# EasyEDA Pro project programming_jig.eprj

# Schematic Schematic1
Board Name: Board1; Create Date: 2026-01-15; Page Name: P1; Project Name: programming_jig; Schematic Name: Schematic1; Update Date: 2026-01-15; Company: EasyEDA.com; Page Size: A4; Version: V1.0
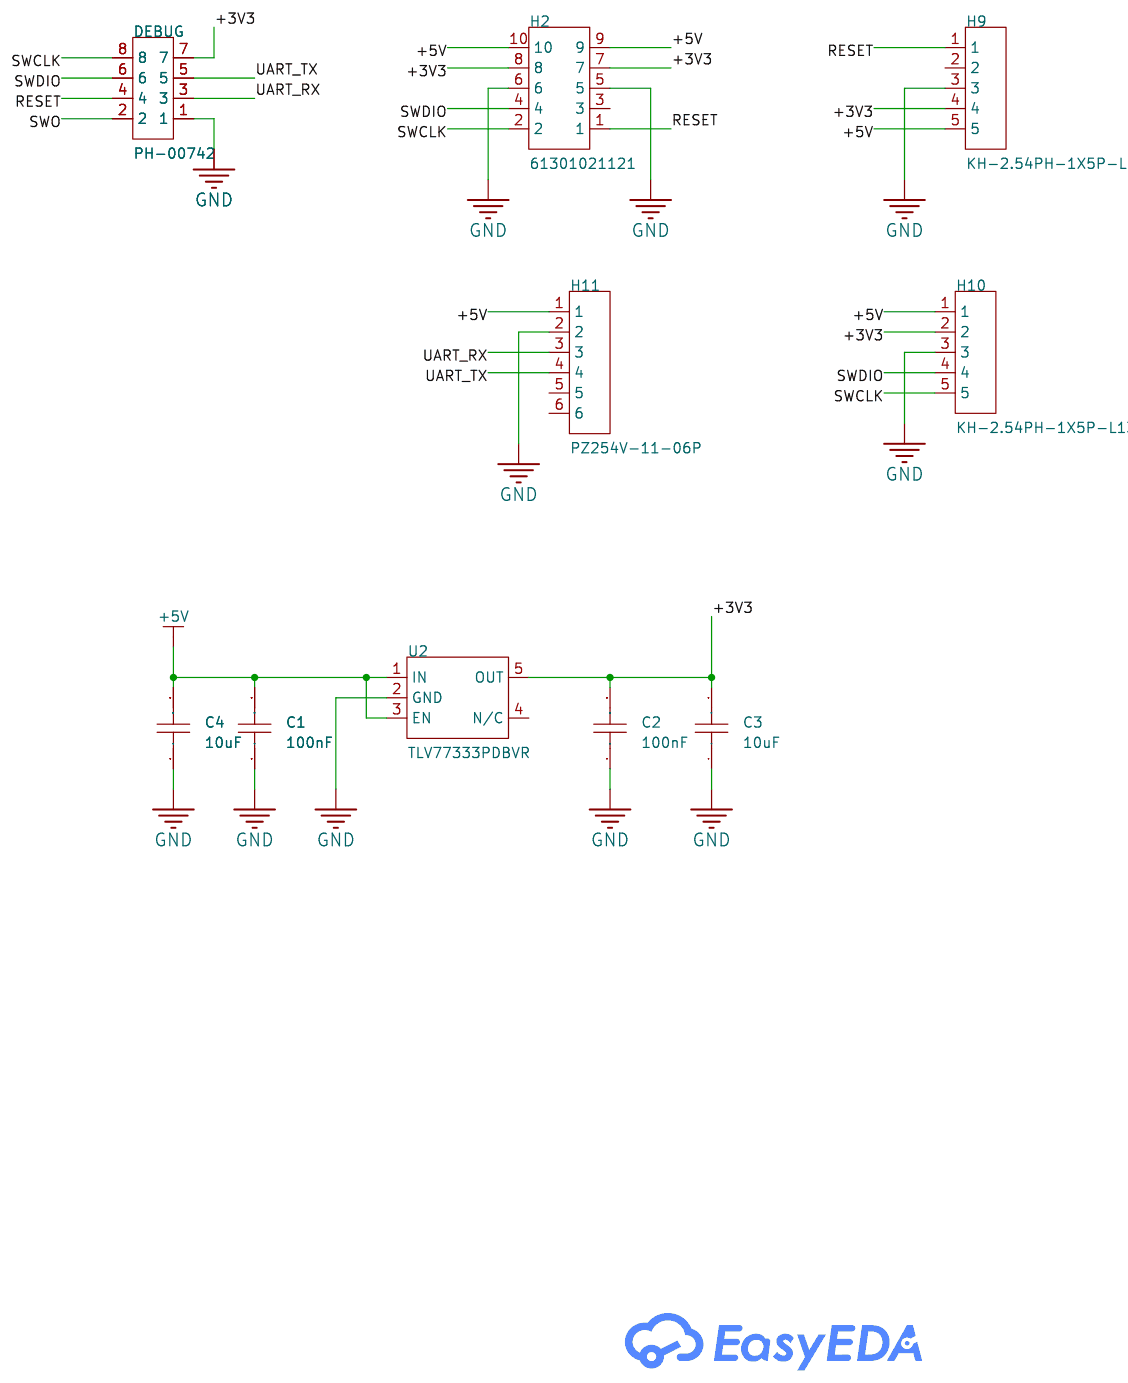
[diagram p0: schematic sheet]

## Parts
C1  100nF  [C0805]
C2  100nF  [C0805]
C3  10uF  [C0805]
C4  10uF  [C0805]
DEBUG  PH-00742  [HDR-TH_8P-P1.27-V-M-R2-C4-S1.27]
H2  61301021121  [HDR-TH_10P-P2.54-V-M-R2-C5-S2.54]
H9  KH-2.54PH-1X5P-L13.5-WT  [HDR-SMD_5P-P2.54_KH-2.54PH-1X5P-L13.5-WT]
H10  KH-2.54PH-1X5P-L13.5-WT  [HDR-SMD_5P-P2.54_KH-2.54PH-1X5P-L13.5-WT]
H11  PZ254V-11-06P  [HDR-TH_6P-P2.54-V-M]
U2  TLV77333PDBVR  [SOT-23-5_L2.9-W1.6-P0.95-LS2.8-BR]

## Library data of the parts
C1 C2 = CC0805KRX7R9BB104: Capacitance:100nF Tolerance:±10% Tolerance:±10% Voltage Rating:50V Temperature Coefficient:X7R; LCSC Part Name: 100nF ±10% 50V; Supplier Part: C49678; Manufacturer: YAGEO(国巨); Supplier Footprint: 0805; JLCPCB Part Class: Basic Part; Datasheet: https://item.szlcsc.com/datasheet/CC0805KRX7R9BB104/50686.html; Supplier: LCSC; Tolerance: ±10%; Voltage Rating: 50V; Temperature Coefficient: X7R
C3 C4 = GRM21BR61H106KE43L: Capacitance:10uF Tolerance:±10% Tolerance:±10% Voltage Rating:50V Temperature Coefficient:X5R; LCSC Part Name: 10uF ±10% 50V; Supplier Part: C440198; Manufacturer: muRata(村田); Supplier Footprint: 0805; JLCPCB Part Class: Basic Part; Datasheet: https://item.szlcsc.com/datasheet/GRM21BR61H106KE43L/439567.html; Supplier: LCSC; Tolerance: ±10%; Voltage Rating: 50V; Temperature Coefficient: X5R
DEBUG = PH-00742: Pin Structure:2x4P Pitch:1.27mm Row Spacing:1.27mm Circluar Pins/Square Pins:Pin Header Mounting Type:Through Hole Number of Rows:2 Number of Pins:8P Current Rating:1A Voltage Rating (Max):- Length of Mating Pin:3mm Insulation Height:2mm Length of End Con; LCSC Part Name: 2x4P 间距:1.27mm 方针 直插; Supplier Part: C2685182; Manufacturer: Liansheng(连盛); Supplier Footprint: 插件,P=1.27mm; JLCPCB Part Class: Extended Part; Datasheet: https://item.szlcsc.com/datasheet/PH-00742/2784456.html; Supplier: LCSC; Pin Structure: 2x4P; Pitch: 1.27mm; Row Spacing: 1.27mm; Circluar Pins/Square Pins: Pin Header; Mounting Type: Through Hole; Number of Rows: 2; Number of Pins: 8P; Current Rating: 1A; Length of Mating Pin: 3mm; Insulation Height: 2mm; Length of End Connection Pin: 2mm; Operating Temperature: -40℃~+105℃; Color: Black
H2 = 61301021121: LCSC Part Name: 2x5P 间距:2.54mm 方针 直插; Supplier Part: C5343117; Manufacturer: Wurth(伍尔特); Supplier Footprint: 插件,P=2.54mm; JLCPCB Part Class: Extended Part; Datasheet: https://www.we-online.com/components/products/datasheet/61301021121.pdf; Supplier: LCSC; Pin Structure: 2x5P; Pitch: 2.54mm; Row Spacing: 2.54mm; Circluar Pins/Square Pins: Pin Header; Mounting Type: Through Hole; Number of Rows: 2; Number of Pins: 10P; Current Rating: 3A; Voltage Rating (Max): 250V; Length of Mating Pin: 6mm; Contact Material: Copper alloy; Operating Temperature: -40℃~+105℃; Color: Black
H9 H10 = KH-2.54PH-1X5P-L13.5-WT: LCSC Part Name: 1x5P 间距:2.54mm 方针 卧贴; Supplier Part: C20610214; Manufacturer: kinghelm(金航标); Supplier Footprint: SMD,P=2.54mm,卧贴; JLCPCB Part Class: Extended Part; Datasheet: https://item.szlcsc.com/datasheet/KH-2.54PH-1X5P-L13.5-WT/21960859.html; Supplier: LCSC; Pin Structure: 1x5P; Pitch: 2.54mm; Circluar Pins/Square Pins: Pin Header; Mounting Type: Surface Mount, Right Angle; Number of Rows: 1; Number of Pins: 5P; Current Rating: 3A; Length of Mating Pin: 6mm; Insulation Height: 2.5mm; Contact Material: Brass; Contact Plating: Gold; Operating Temperature: -40℃~+105℃; Color: Black
H11 = PZ254V-11-06P: LCSC Part Name: 1x6P 间距:2.54mm 方针 直插; Supplier Part: C492405; Manufacturer: XFCN(兴飞); Supplier Footprint: 插件,P=2.54mm; JLCPCB Part Class: Extended Part; Datasheet: https://item.szlcsc.com/datasheet/PZ254V-11-06P/502961.html; Supplier: LCSC; Pin Structure: 1x6P; Pitch: 2.54mm; Circluar Pins/Square Pins: Pin Header; Mounting Type: Through Hole; Number of Rows: 1; Number of Pins: 6P; Length of Mating Pin: 6mm; Insulation Height: 2.5mm; Length of End Connection Pin: 3mm; Contact Material: Brass; Operating Temperature: -40℃~+105℃; Color: Black
U2 = TLV77333PDBVR: Supplier Part: C32445874; Manufacturer: TI(德州仪器); Supplier Footprint: SOT-23-5; JLCPCB Part Class: Extended Part; Supplier: LCSC

## Nets
+3V3: C2.2 C3.2 DEBUG.7 H2.7 H2.8 H9.4 H10.2 U2.5(OUT)
+5V: C1.2 C4.2 H2.9 H2.10 H9.5 H10.1 H11.1 U2.1(IN) U2.3(EN)
GND: C1.1 C2.1 C3.1 C4.1 DEBUG.1 H2.5 H2.6 H9.3 H10.3 H11.2 U2.2(GND)
RESET: DEBUG.4 H2.1 H9.1
SWCLK: DEBUG.8 H2.2 H10.5
SWDIO: DEBUG.6 H2.4 H10.4
SWO: DEBUG.2
UART_RX: DEBUG.3 H11.3
UART_TX: DEBUG.5 H11.4

Not connected (* = marked no-connect by the designer): H2 3; H9 2; H11 5 6; U2 4(N/C)

# Board PCB1
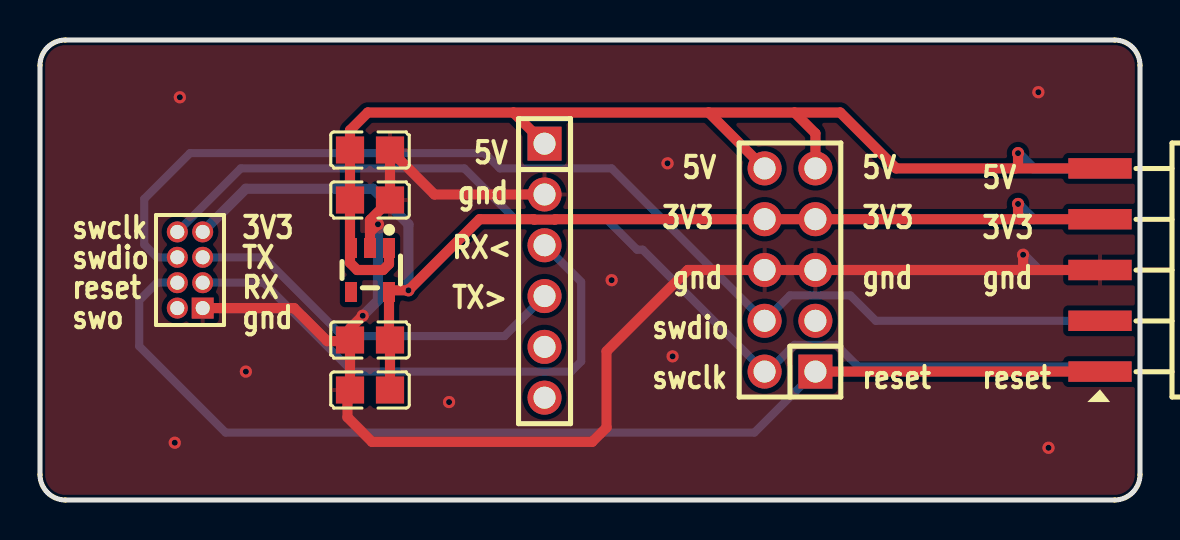
[diagram p1: board, top side]
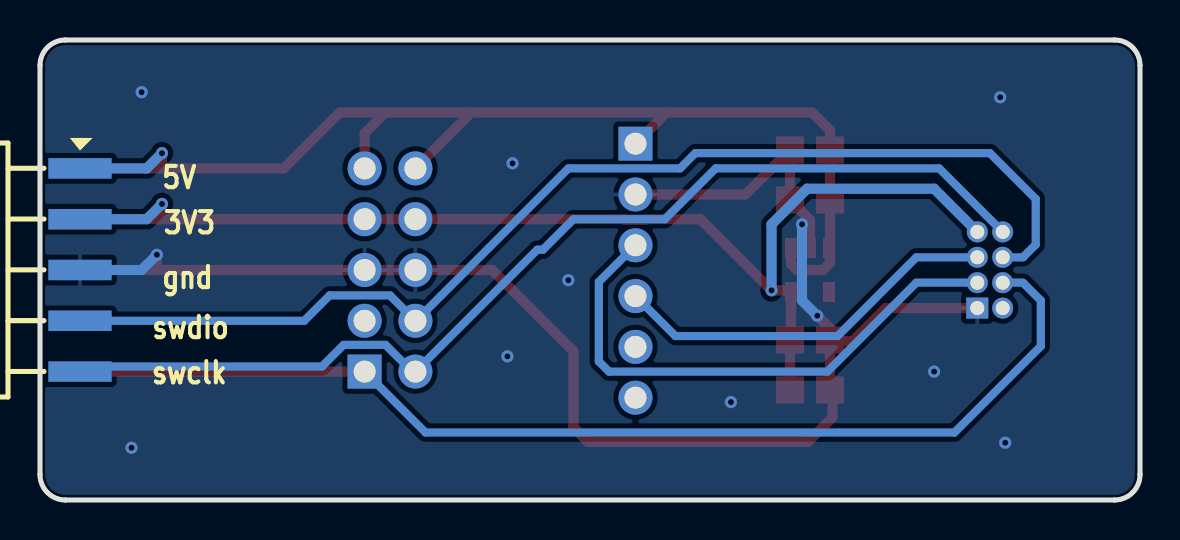
[diagram p2: board, bottom side, seen from below]

Outline 55 x 23 mm; copper layers: Top Layer, Bottom Layer. Coordinates in mm from the lower left corner of the outline.
Outline path: 0,21.73 0,1.27 arc(0.37,0.37) 1.27,0 53.73,0 arc(54.63,0.37) 55,1.27 55,21.73 arc(54.63,22.63) 53.73,23 1.27,23 arc(0.37,22.63) 0,21.73
Stack: Top Layer 0.035mm / Dielectric1 1.51mm FR4 er 4.5 / Bottom Layer 0.035mm

## Design rules (mm)
template: JLCPCB Capability(Two Layers Board)
spacing copperThickness1oz (default): track to track 0.102, other pairs 0.152 to 0.3
spacing copperThickness2oz: track to track 0.203, other pairs 0.152 to 0.3
track width copperThickness1oz (default): min 0.127, default 0.254, max 2.54
track width copperThickness2oz: min 0.203, default 0.254, max 2.54
differential pair differentialPair (default): width min 0.127, default 0.254, max 2.54; gap min 0.152, default 0.152
via viaSize (default): diameter min 0.5, default 0.61, max 10; hole min 0.3, default 0.305, max 6.3

## Placement (name value [footprint] x y rotation side)
C1  100nF  [C0805]  16.5 17.5 180 top
C2  100nF  [C0805]  16.5 8 0 top
C3  10uF  [C0805]  16.5 5.5 0 top
C4  10uF  [C0805]  16.5 15 180 top
DEBUG  PH-00742  [HDR-TH_8P-P1.27-V-M-R2-C4-S1.27]  7.5 11.5 90 top
H2  61301021121  [HDR-TH_10P-P2.54-V-M-R2-C5-S2.54]  37.5 11.5 90 top
H9  KH-2.54PH-1X5P-L13.5-WT  [HDR-SMD_5P-P2.54_KH-2.54PH-1X5P-L13.5-WT]  53 11.5 90 top
H10  KH-2.54PH-1X5P-L13.5-WT  [HDR-SMD_5P-P2.54_KH-2.54PH-1X5P-L13.5-WT]  53 11.5 270 bottom
H11  PZ254V-11-06P  [HDR-TH_6P-P2.54-V-M]  25.23 11.47 270 top
U2  TLV77333PDBVR  [SOT-23-5_L2.9-W1.6-P0.95-LS2.8-BR]  16.5 11.5 90 top

## Footprints (pads in the part's own frame, mm; a bottom-side part is the same pattern mirrored in y, then rotated)
C0805
  rect 1.41x1.35 smd: 1(-1,0) 2(1,0)
HDR-SMD_5P-P2.54_KH-2.54PH-1X5P-L13.5-WT
  rect 1.02x3.16 smd: 1(-5.08,0) 2(-2.54,0) 3(0,0) 4(2.54,0) 5(5.08,0)
HDR-TH_6P-P2.54-V-M
  rect 1.7x1.7 hole 1.1: 1(-6.35,0)
  round 1.7 hole 1.1: 2(-3.81,0) 3(-1.27,0) 4(1.27,0) 5(3.81,0) 6(6.35,0)
HDR-TH_8P-P1.27-V-M-R2-C4-S1.27
  rect 1.05x1.1 hole 0.7: 1(-1.905,-0.635)
  round 1.05 hole 0.7: 2(-1.905,0.635) 3(-0.635,-0.635) 4(-0.635,0.635) 5(0.635,-0.635) 6(0.635,0.635) 7(1.905,-0.635) 8(1.905,0.635)
HDR-TH_10P-P2.54-V-M-R2-C5-S2.54
  rect 1.7x1.7 hole 1.1: 1(-5.08,-1.27)
  round 1.7 hole 1.1: 2(-5.08,1.27) 3(-2.54,-1.27) 4(-2.54,1.27) 5(0,-1.27) 6(0,1.27) 7(2.54,-1.27) 8(2.54,1.27) 9(5.08,-1.27) 10(5.08,1.27)
SOT-23-5_L2.9-W1.6-P0.95-LS2.8-BR
  rect 1x0.6 smd: 1(1.1,-0.95) 2(1.1,0) 3(1.1,0.95) 4(-1.1,0.95) 5(-1.1,-0.95)

## Nets
As in the schematic.

Pads without a net: H2 3; H9 2; H11 5 6; U2 4

## Via types
v1: diameter 0.61, hole 0.305, Top Layer to Bottom Layer, 15 vias

## Routing (per net, layer and track width the routed paths; a pad name or vN(x,y) marks a point on that pad's centre or on a via; arc(x,y) is an arc through that point)
+3V3: length 62.4
  Top Layer w0.508: 48.99,14.04 48.9,14.12 v1(48.9,14.8) ; 48.99,14.04 H2.7 H2.8 25.77,14.04 25.75,14.02 24.71,14.02 24.69,14.04 21.98,14.04 v1(18.42,10.48) 17.53,10.48 U2.5 17.45,8.05 C2.2 C3.2 ; 48.99,14.04 H9.4
  Bottom Layer w0.508: v1(48.9,14.8) 49.66,14.04 H9.4 ; v1(18.42,10.48) 18.42,13.79 16.64,15.56 10.29,15.56 DEBUG.7
+5V: length 63.3
  Top Layer w0.508: 48.76,16.58 48.9,16.73 v1(48.9,17.34) ; 48.76,16.58 42.81,16.58 40.01,19.37 37.73,19.37 ; 48.76,16.58 H9.5 ; 23.67,19.37 H11.1 ; 23.67,19.37 16.39,19.37 15.5,18.48 C1.2 C4.2 15.5,11.86 15.86,11.5 17.15,11.5 17.45,11.8 U2.1 ; 23.67,19.37 33.44,19.37 ; H2.9 38.77,18.33 37.73,19.37 ; 33.44,19.37 H2.10 ; 33.44,19.37 37.73,19.37
  Bottom Layer w0.508: H9.5 49.66,16.58 v1(48.9,17.34)
GND: length 82.2
  Top Layer w0.508: 16.5,13.39 16.5,14 C4.1 C1.1 19.72,15.28 H11.2 ; 16.5,13.39 U2.2 ; 16.5,13.39 v1(16.9,13.79) ; H9.3 49.08,11.5 ; 49.08,11.5 H2.5 H2.6 32.39,11.5 28.33,7.44 28.33,3.63 27.61,2.91 16.6,2.91 15.37,4.13 15.37,5.84 15.5,5.97 ; 49.08,11.5 49.16,11.58 v1(49.16,12.26) ; 15.5,5.97 C2.1 ; 15.5,5.97 C3.1 ; DEBUG.1 12.71,9.59 14.36,7.94 15.44,7.94 C2.1 ; C2.1 15.5,8.58 v1(16.14,9.21)
  Bottom Layer w0.508: H9.3 49.92,11.5 v1(49.16,12.26) ; v1(16.9,13.79) 16.9,9.98 v1(16.14,9.21)
  vias: v1(6.74,2.86) v1(6.99,20.14) v1(10.29,6.42) v1(20.45,4.9) v1(28.58,10.99) v1(31.38,16.83) v1(31.63,7.18) v1(49.92,20.39) v1(50.43,2.61)
RESET: length 55.7
  Top Layer w0.508: H9.1 H2.1
  Bottom Layer w0.406: H2.1 35.72,3.37 9.28,3.37 4.96,7.69 4.96,9.98 5.85,10.86 DEBUG.4
SWCLK: length 52.8
  Bottom Layer w0.406: DEBUG.8 10.04,16.58 21.22,16.58 23.76,14.04 28.33,14.04 29.85,12.52 30.13,12.52 H2.2 36.48,6.67 36.64,6.67 37.72,7.75 39.82,7.75 40.9,6.67 52.75,6.67 H10.5
SWDIO: length 57.4
  Bottom Layer w0.406: DEBUG.6 5.85,12.14 5.21,12.77 5.21,15.06 7.5,17.34 22.23,17.34 22.99,16.58 28.58,16.58 36.2,8.96 ; H10.4 41.79,8.96 40.52,10.23 37.5,10.23 H2.4
UART_RX: length 27.5
  Bottom Layer w0.406: DEBUG.3 11.18,10.86 15.63,6.42 26.55,6.42 27.06,6.93 27.06,10.91 H11.3
UART_TX: length 19.6
  Bottom Layer w0.406: H11.4 23.23,8.2 15.12,8.2 11.18,12.14 DEBUG.5

## Copper pours and planes (outline as drawn; the poured copper is in the pictures)
GND on Top Layer: -3.93,28.52 62.87,28.52 62.87,-5.52 -3.93,-5.52
GND on Bottom Layer: -2.66,27.25 57.03,27.25 57.03,-19.23 -2.66,-19.23

## Text on the board
Bottom Silkscreen Layer: 3V3 | 5V | gnd | swdio | swclk
Top Silkscreen Layer: swclk | swdio | reset | swo | 3V3 | TX | RX | gnd | RX< | TX> | 5V
